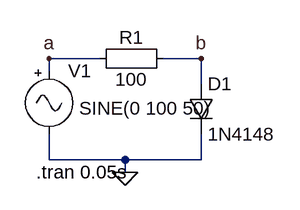
[diagram p0: schematic limiter_diod_positive_100V.asc]
limiter_diod_positive_100V.asc, the LTspice schematic file:
Version 4
SHEET 1 880 680
WIRE 16 208 -48 208
WIRE 144 208 96 208
WIRE -48 224 -48 208
WIRE 144 240 144 208
WIRE -48 336 -48 304
WIRE 48 336 -48 336
WIRE 144 336 144 304
WIRE 144 336 48 336
WIRE 48 352 48 336
FLAG -48 208 a
FLAG 144 208 b
FLAG 48 352 0
SYMBOL diode 128 240 R0
SYMATTR InstName D1
SYMATTR Value 1N4148
SYMBOL Misc\\signal -48 208 R0
WINDOW 123 0 0 Left 2
WINDOW 39 0 0 Left 2
WINDOW 3 38 63 Left 2
SYMATTR Value SINE(0 100 50)
SYMATTR InstName V1
SYMBOL Misc\\EuropeanResistor 112 192 R90
WINDOW 0 5 56 VBottom 2
WINDOW 3 27 56 VTop 2
SYMATTR InstName R1
SYMATTR Value 100
TEXT -64 352 Left 2 !.tran 0.05s

The netlist it stands for:
* limiter_diod_positive_100V.asc
D1 b 0 1N4148
V1 a 0 SINE(0 100 50)
R1 b a 100
.model D D
.lib standard.dio
.tran 0.05s
.backanno
.end